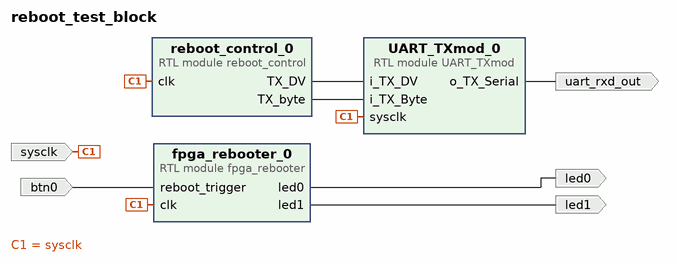
[diagram p0: block diagram of the top level]
# Vivado block design reboot_test_block, xc7a35tcpg236-1, Vivado 2024.2
create_bd_design reboot_test_block

create_bd_port -dir I sysclk
create_bd_port -dir I btn0
create_bd_port -dir O uart_rxd_out
create_bd_port -dir O led0
create_bd_port -dir O led1

create_bd_cell -type module -reference fpga_rebooter fpga_rebooter_0
create_bd_cell -type module -reference reboot_control reboot_control_0
create_bd_cell -type module -reference UART_TXmod UART_TXmod_0

# ---- connections ----

connect_bd_net [get_bd_pins UART_TXmod_0/o_TX_Serial] [get_bd_ports uart_rxd_out]
connect_bd_net -net btn0_1 [get_bd_ports btn0] [get_bd_pins fpga_rebooter_0/reboot_trigger]
connect_bd_net [get_bd_pins fpga_rebooter_0/led0] [get_bd_ports led0]
connect_bd_net [get_bd_pins fpga_rebooter_0/led1] [get_bd_ports led1]
connect_bd_net -net reboot_control_0_DV [get_bd_pins reboot_control_0/TX_DV] [get_bd_pins UART_TXmod_0/i_TX_DV]
connect_bd_net -net reboot_control_0_byte [get_bd_pins reboot_control_0/TX_byte] [get_bd_pins UART_TXmod_0/i_TX_Byte]
connect_bd_net [get_bd_ports sysclk] [get_bd_pins UART_TXmod_0/sysclk] [get_bd_pins fpga_rebooter_0/clk] [get_bd_pins reboot_control_0/clk]

validate_bd_design
save_bd_design
